# EasyEDA schematic 1-Schematic_EEPROM Writer.json
TITLE: Sheet_1; REV: 1.0; Date: 2021-01-31; Sheet: 1/1; Drawn By: quinnpainter; Company: Your Company
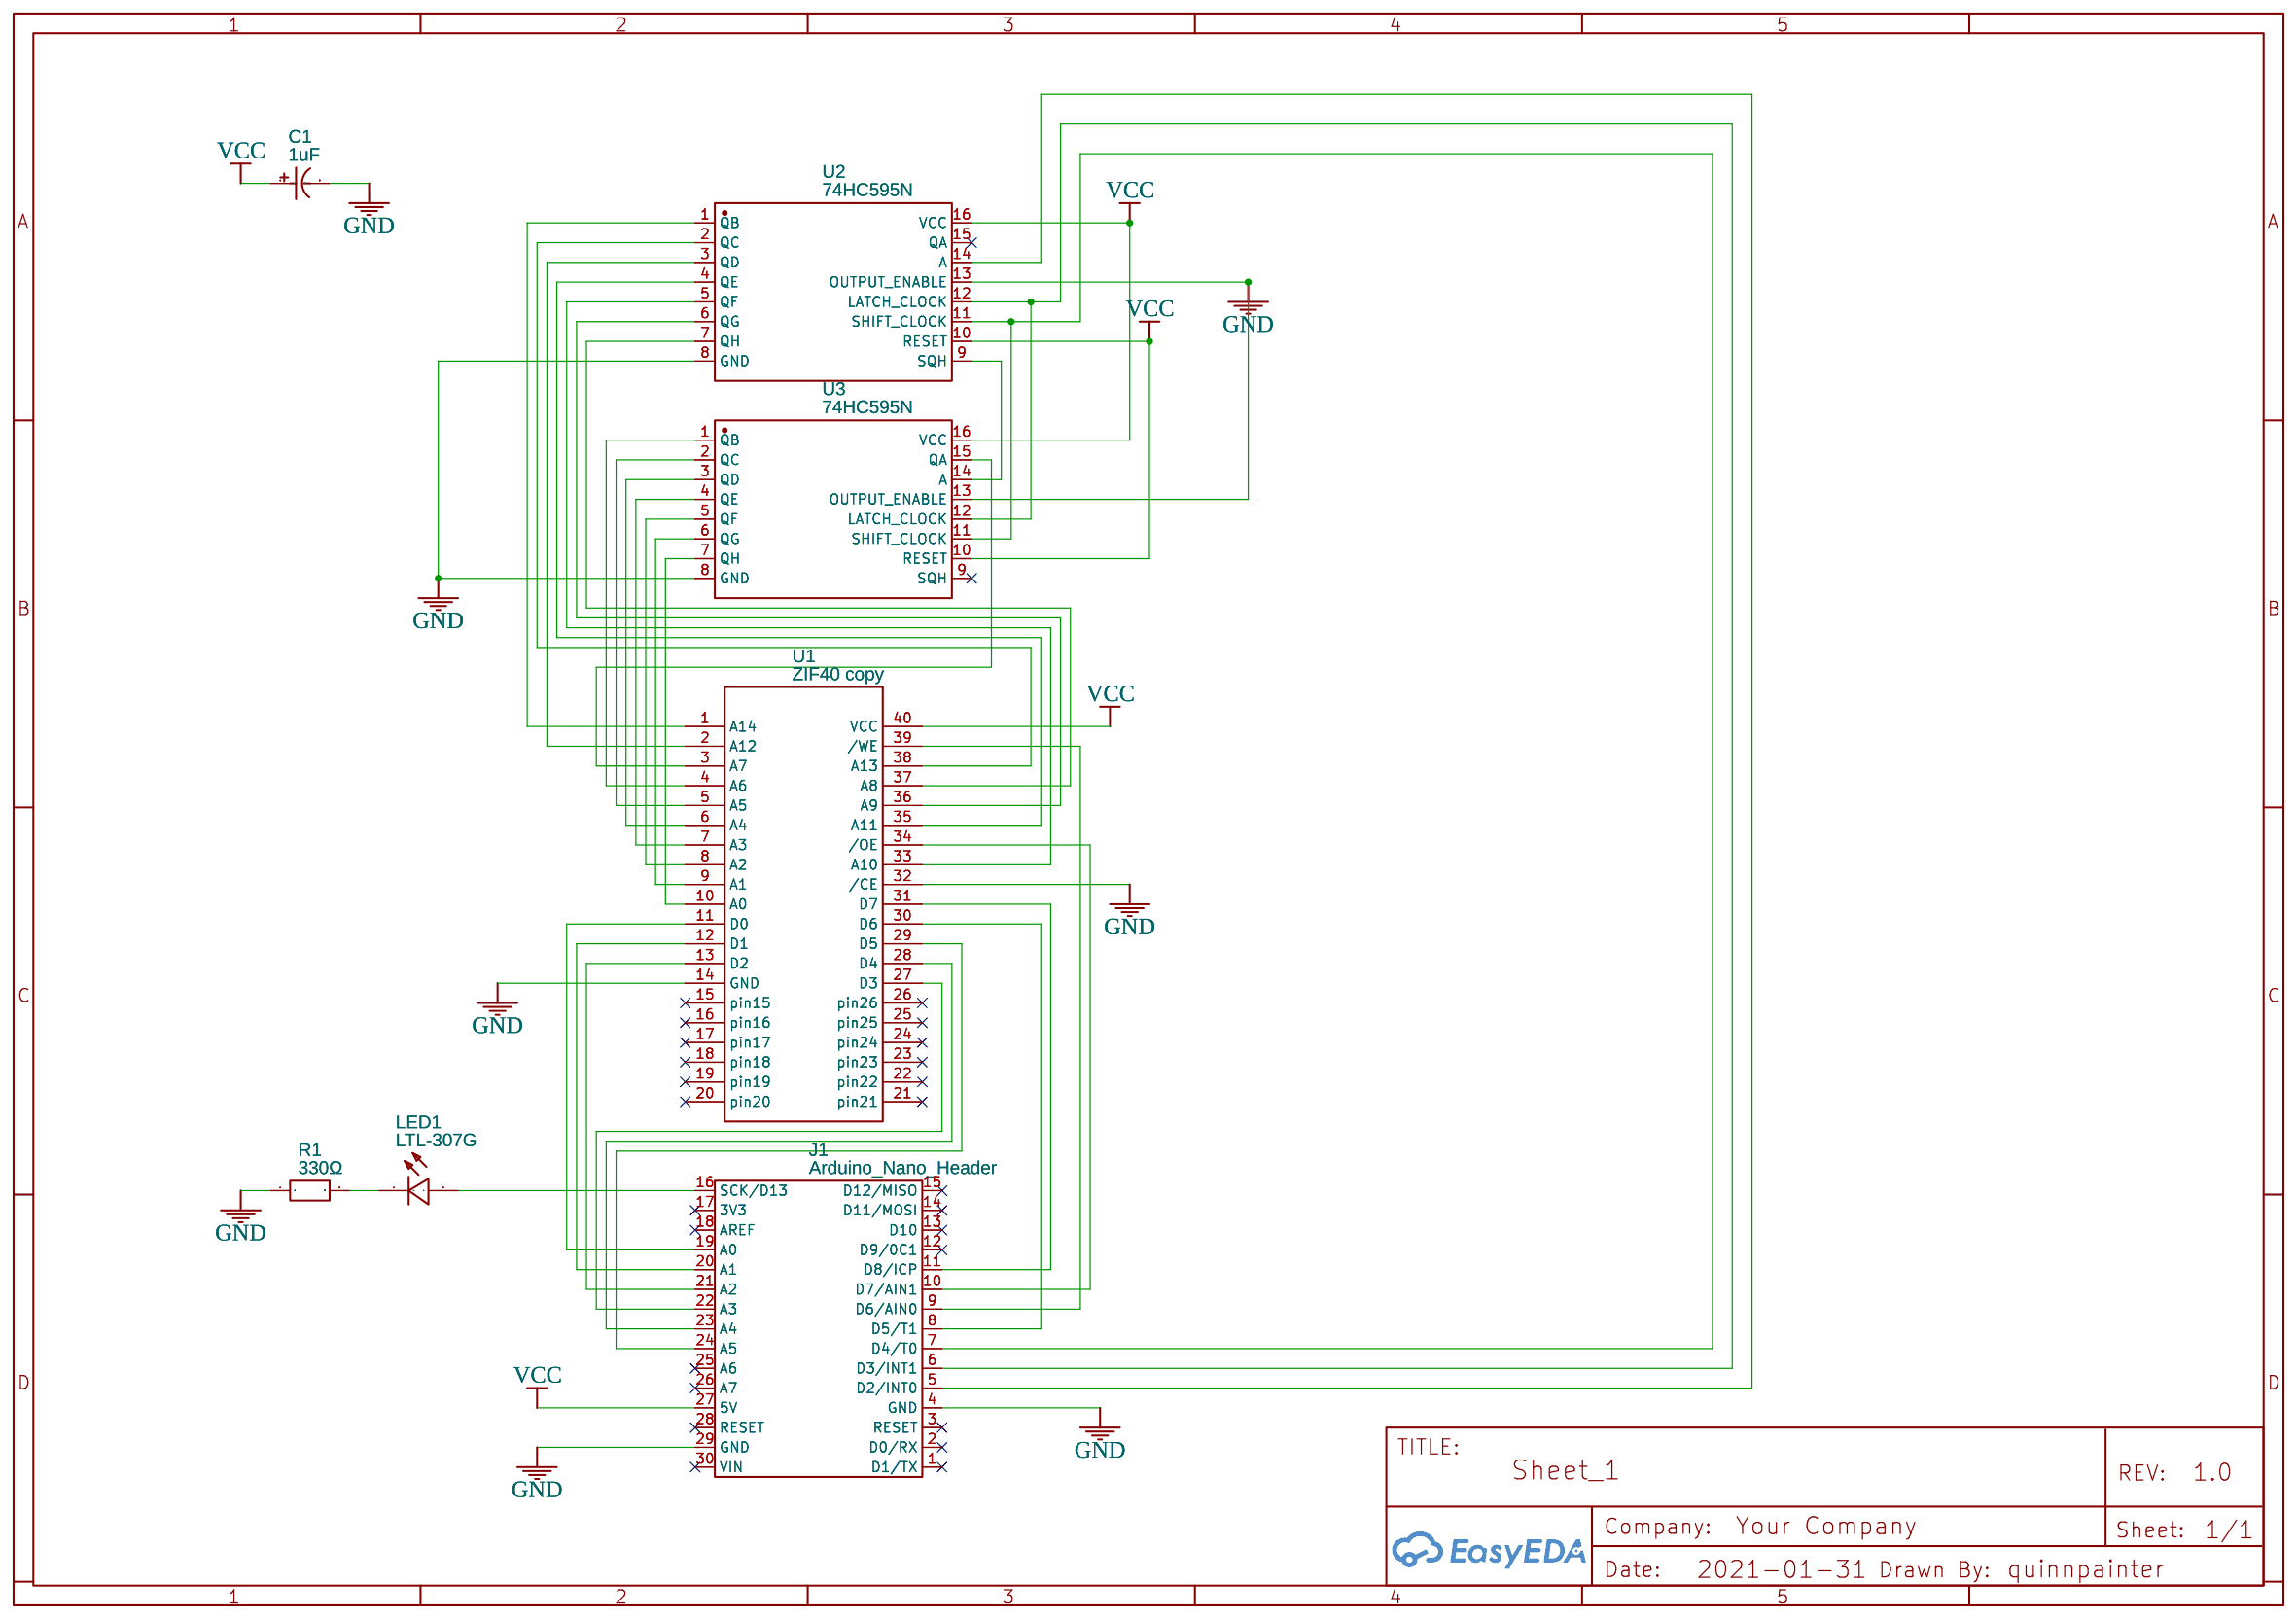
[diagram p0: schematic sheet]

## Parts
C1  1uF  [CAP-TH_BD4.0-P1.50-D0.8-FD]
J1  Arduino_Nano_Header  [DIP-30_L43.18-W15.24-ARDUINONANO]
LED1  LTL-307G  [LED-TH_BD5.9-P2.54-RD]
R1  330Ω  [RES-TH_BD2.3-L6.5-P10.50-D0.5]
U1  ZIF40 copy  [DIP40]
U2  74HC595N  [DIP-16_L20.0-W6.4-P2.54-LS7.6-BL]
U3  74HC595N  [DIP-16_L20.0-W6.4-P2.54-LS7.6-BL]

## Library data of the parts
C1 = 1uF 50V 4*5: Supplier: LCSC; Manufacturer: ValuePro; Supplier Part: C47848
J1 = Arduino_Nano_Header
LED1 = LTL-307G: Supplier: LCSC; Supplier Part: C125080; Manufacturer: Lite-On; Contributor: LCSC; LCSC Assembly: Yes; SMT Type: Extend
R1 = MF1/4W-330Ω±1%T52: Supplier: LCSC; Supplier Part: C713986; Manufacturer: Huaxing Mechanical-Elec.; Contributor: LCSC
U1 = ZIF40 copy: zif 40 adapter
U2 U3 = 74HC595N: Supplier: LCSC; Supplier Part: C507175; Manufacturer: HGSEMI; Contributor: LCSC

## Nets
GND: C1.2 J1.4(GND) J1.29(GND) R1.1 U1.14(GND) U1.32(/CE) U2.8(GND) U2.13(OUTPUT_ENABLE) U3.8(GND) U3.13(OUTPUT_ENABLE)
VCC: C1.1 J1.27(5V) U1.40(VCC) U2.10(RESET) U2.16(VCC) U3.10(RESET) U3.16(VCC)
Net-(J1-5): J1.5(D2/INT0) U2.14(A)
Net-(J1-6): J1.6(D3/INT1) U2.12(LATCH_CLOCK) U3.12(LATCH_CLOCK)
Net-(J1-7): J1.7(D4/T0) U2.11(SHIFT_CLOCK) U3.11(SHIFT_CLOCK)
Net-(J1-8): J1.8(D5/T1) U1.30(D6)
Net-(J1-9): J1.9(D6/AIN0) U1.39(/WE)
Net-(J1-10): J1.10(D7/AIN1) U1.34(/OE)
Net-(J1-11): J1.11(D8/ICP) U1.31(D7)
Net-(J1-16): J1.16(SCK/D13) LED1.2(+)
Net-(J1-19): J1.19(A0) U1.11(D0)
Net-(J1-20): J1.20(A1) U1.12(D1)
Net-(J1-21): J1.21(A2) U1.13(D2)
Net-(J1-22): J1.22(A3) U1.27(D3)
Net-(J1-23): J1.23(A4) U1.28(D4)
Net-(J1-24): J1.24(A5) U1.29(D5)
Net-(LED1-1): LED1.1(-) R1.2
Net-(U1-1): U1.1(A14) U2.1(QB)
Net-(U1-2): U1.2(A12) U2.3(QD)
Net-(U1-3): U1.3(A7) U3.15(QA)
Net-(U1-4): U1.4(A6) U3.1(QB)
Net-(U1-5): U1.5(A5) U3.2(QC)
Net-(U1-6): U1.6(A4) U3.3(QD)
Net-(U1-7): U1.7(A3) U3.4(QE)
Net-(U1-8): U1.8(A2) U3.5(QF)
Net-(U1-9): U1.9(A1) U3.6(QG)
Net-(U1-10): U1.10(A0) U3.7(QH)
Net-(U1-33): U1.33(A10) U2.5(QF)
Net-(U1-35): U1.35(A11) U2.4(QE)
Net-(U1-36): U1.36(A9) U2.6(QG)
Net-(U1-37): U1.37(A8) U2.7(QH)
Net-(U1-38): U1.38(A13) U2.2(QC)
Net-(U2-9): U2.9(SQH) U3.14(A)

Not connected (* = marked no-connect by the designer): J1 1(D1/TX)* 2(D0/RX)* 3(RESET)* 12(D9/0C1)* 13(D10)* 14(D11/MOSI)* 15(D12/MISO)* 17(3V3)* 18(AREF)* 25(A6)* 26(A7)* 28(RESET)* 30(VIN)*; U1 15(pin15)* 16(pin16)* 17(pin17)* 18(pin18)* 19(pin19)* 20(pin20)* 21(pin21)* 22(pin22)* 23(pin23)* 24(pin24)* 25(pin25)* 26(pin26)*; U2 15(QA)*; U3 9(SQH)*
